# EAGLE design PCB-REMCON (EAGLE 6.4)
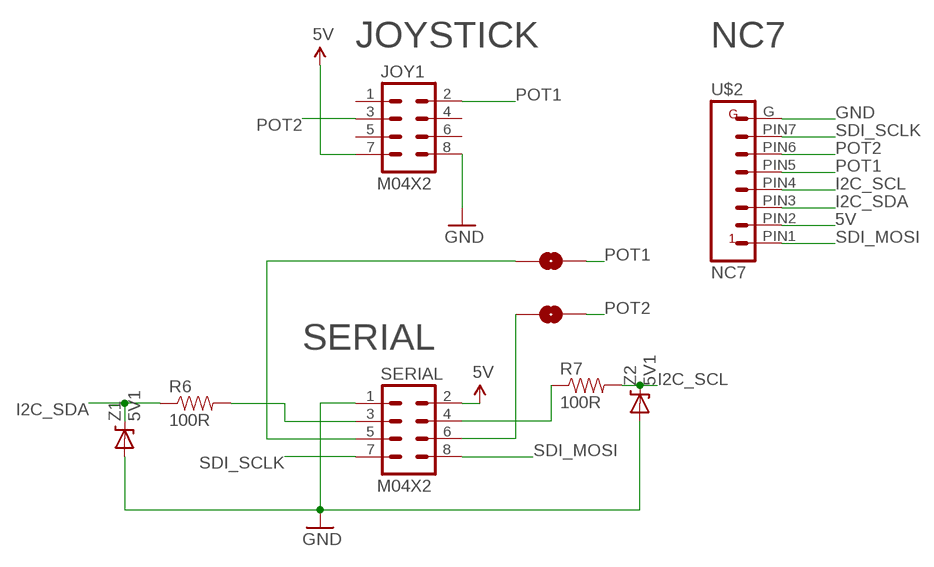
[diagram p0: schematic, sheet 1]

## Parts
JOY1  M04X2  [2X4]
R6  100R  RESISTOR0603-RES  [0603-RES]
R7  100R  RESISTOR0603-RES  [0603-RES]
SCLK->D1  SOLDERJUMPERNC  [SJ_2S]
SCLK->D5  SOLDERJUMPERNC  [SJ_2S]
SERIAL  M04X2  [2X4]
U$2  NC7  [NC7-MD-L1]
Z1  5V1  DIODE-ZENERPTH  [DIODE-ZENER]
Z2  5V1  DIODE-ZENERPTH  [DIODE-ZENER]

## Nets
5V [Power]: JOY1.7 SERIAL.2 U$2.PIN2
GND [Power]: JOY1.8 SERIAL.1 U$2.G Z1.P$2(A) Z2.P$2(A)
I2C_SCL: R7.2 U$2.PIN4 Z2.P$1(C)
I2C_SDA: R6.1 U$2.PIN3 Z1.P$1(C)
N$1: R6.2 SERIAL.3
N$2: SCLK->D5.1 SERIAL.6
N$3: SCLK->D1.1 SERIAL.5
N$14: R7.1 SERIAL.4
POT1: JOY1.2 SCLK->D1.2 U$2.PIN5
POT2: JOY1.3 SCLK->D5.2 U$2.PIN6
SDI_MOSI: SERIAL.8 U$2.PIN1
SDI_SCLK: SERIAL.7 U$2.PIN7
Unconnected: JOY1.1 JOY1.4 JOY1.5 JOY1.6

## Notes on the sheet
- JOYSTICK | NC7
- SERIAL

## Library data of the parts
JOY1 SERIAL = SparkFun:M04X2
R6 R7 = SparkFun:RESISTOR: Resistor Basic schematic elements and footprints for 0603, 1206, and PTH resistors.
SCLK->D1 SCLK->D5 = SparkFun:SOLDERJUMPER: Solder Jumper Standard SMD solder jumper. Used to automate production. Two varients : Normally Open and Normally Closed are the same, but have different paste layers. NC will have a large amount of paste and should jumper during reflow.
U$2 = SKAARHOJ:NC7
Z1 Z2 = SparkFun:DIODE-ZENER: Zener Diode Production Part - 8199 3.4V Zener Voltage

## Net classes
0 default: width 0.203 mm, drill 0.406 mm, clearance 0.203 mm
1 Power: width 0.406 mm, drill 0.61 mm, clearance 0.203 mm

## Board
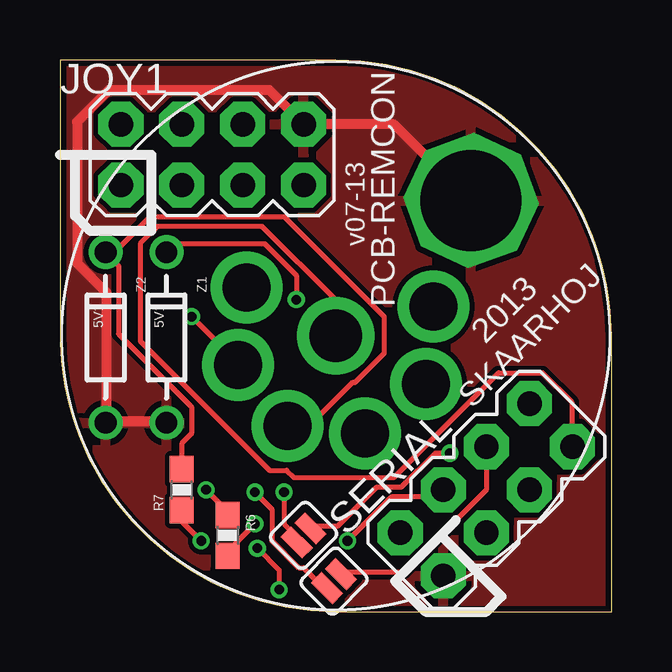
[diagram p1: board, top side]
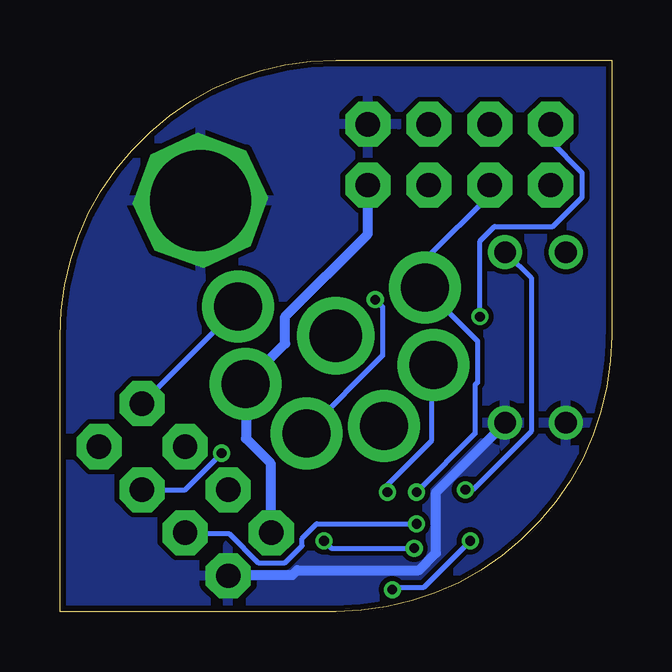
[diagram p2: board, bottom side, seen from below]

Size 23 x 23 mm. Coordinates in mm from the lower left corner, seen from the top.
Outline: 11.5,0 23,0 23,11.5 arc90 11.5,23 0,23 0,11.5
Outline: 0,11.5 arc90 11.5,0
Outline: 0,11.5 arc90 11.5,0
Copper layers (1*16): Top 0.035mm / dielectric 1.5mm / Bottom 0.035mm
Design rules "Fusion_eagle_rule_v1.1": minimum track width 6mil, minimum drill 12mil, track to track 6mil, track to pad 6mil, pad to pad 6mil, via to via 6mil, smd to smd 0mil, copper to edge 10mil, drill to drill 10mil, minimum pad ring 10mil, minimum via ring 6mil, stop-mask expansion 2mil, vias tented up to drill 100mil, thermal gap 10mil

### Footprints (pad centres in the part's own frame; a part is rotated, then mirrored left to right if it is on the bottom)
2X4 = drill 1.016 pad 1.88 octagon: 1 -3.81,-1.27; 2 -3.81,1.27; 3 -1.27,-1.27; 4 -1.27,1.27; 5 1.27,-1.27; 6 1.27,1.27; 7 3.81,-1.27; 8 3.81,1.27
0603-RES = smd 1.1 x 1: 1 -0.85,0; 2 0.85,0
SJ_2S = smd 0.635 x 1.27: 1 -0.412,0; 2 0.412,0
NC7-MD-L1 = drill 4.2 octagon: G 5.64,5.64 | drill 2: PIN1 4.068,1.22; PIN2 3.76,-2.01; PIN3 1.22,-4.07; PIN4 -2.01,-3.76; PIN5 -4.07,-1.22; PIN6 -3.72,2.01 | drill 2.2: PIN7 0,0
DIODE-ZENER = drill 0.9: P$1 -3.556,0; P$2 3.556,0

### Placement (x,y rotation side)
JOY1  6.35,19.05 0 top
R6  6.99,3.17 270 top
R7  5.08,5.08 90 top
SCLK->D1  10.16,3.17 225 top
SCLK->D5  11.43,1.27 225 top
SERIAL  17.78,5.08 45 top
U$2  11.5,11.5 0 top
Z1  4.45,11.43 270 top
Z2  1.91,11.43 270 top

### Tracks (layer width: path | path; a pad name or v marks a point on that pad's centre or on a via)
5V
  Bottom 0.406: SERIAL.2 14.22,3.35 14.22,6.2 15.24,7.21 15.24,9.45 U$2.PIN2 15.14,9.65 13.61,11.18 13.61,12.29 10.16,15.75 JOY1.7
GND
  Top 0.406: Z1.P$2 4.37,7.92 1.93,7.92 Z2.P$2 1.93,8.13 1.93,13.31 0.71,14.53 0.71,20.42 2.03,21.74 8.74,21.74 JOY1.8 13.92,20.32 17.07,17.17 U$2.G
  Bottom 0.406: Z1.P$2 4.47,7.82 7.32,4.98 7.32,2.44 8.03,1.73 13.11,1.73 13.31,1.52 15.95,1.52 SERIAL.1
  pour Top: 0,0 22.86,0 22.86,22.86 0,22.86
  pour Bottom: 0,0 22.86,0 22.86,22.86 0,22.86
I2C_SCL
  Top 0.203: R7.2 5.08,7.01 5.49,7.42 5.49,8.53 2.44,11.58 2.44,14.43 1.93,14.94 Z2.P$1 2.13,14.83 3.76,16.46 9.35,16.46 13.51,12.29 13.51,10.77 12.29,9.55 12.19,9.55 10.46,7.82 9.55,7.82 U$2.PIN4
I2C_SDA  (via drill 0.41)
  Top 0.203: v6.1,5.08 6.91,4.27 6.91,4.06 R6.1 | v9.86,13.01 9.86,14.02 8.53,15.34 4.78,15.34 4.47,15.04 Z1.P$1
  Bottom 0.203: v6.1,5.08 5.79,5.08 3.35,7.52 3.35,13.92 4.37,14.94 Z1.P$1 | v9.86,13.01 9.55,12.7 9.55,10.67 12.7,7.52 U$2.PIN3
N$1  (via drill 0.41)
  Top 0.203: v8.13,3.66 7.01,2.54 7.01,2.34 R6.2
  Bottom 0.203: v8.13,3.66 12.29,3.66 12.9,3.05 12.9,2.74 13.61,2.03 14.73,2.03 15.95,3.25 17.78,3.25 SERIAL.3
N$2
  Top 0.203: SERIAL.6 17.78,5.08 14.33,1.63 11.79,1.63 SCLK->D5.1
N$3  (via drill 0.41)
  Top 0.203: v16.26,6.6 15.65,6.6 14.22,5.18 13.21,5.18 11.58,3.56 10.46,3.56 SCLK->D1.1
  Bottom 0.203: v16.26,6.6 17.78,5.08 19.51,5.08 SERIAL.5
N$14  (via drill 0.41)
  Top 0.203: R7.1 5.08,3.76 v5.89,2.95 | v9.14,0.91 9.14,1.73 v8.23,2.64 | v11.99,2.95 13.82,4.78 15.65,4.78 15.95,5.08 SERIAL.4
  Bottom 0.203: v5.89,2.95 7.82,1.02 9.04,1.02 v9.14,0.91 | v8.23,2.64 11.68,2.64 v11.99,2.95
POT1  (via drill 0.41)
  Top 0.203: v9.35,4.98 9.35,3.66 9.86,3.15 9.86,2.95 SCLK->D1.2 | v5.49,12.29 7.42,10.36 U$2.PIN5
  Bottom 0.203: v9.35,4.98 9.35,5.28 7.52,7.11 7.52,10.26 U$2.PIN5 | JOY1.2 2.54,19.61 1.22,18.29 1.22,17.27 2.44,16.05 4.88,16.05 5.49,15.44 v5.49,12.29
POT2  (via drill 0.41)
  Top 0.203: v8.13,4.98 8.84,4.27 8.84,2.95 9.96,1.83 10.16,1.83 10.97,1.02 11.07,1.02 SCLK->D5.2
  Bottom 0.203: JOY1.3 5.08,17.37 7.72,14.73 7.72,13.51 U$2.PIN6 7.72,13.41 5.59,11.28 5.59,9.55 5.69,9.45 5.69,7.42 v8.13,4.98
SDI_MOSI
  Bottom 0.203: SERIAL.8 19.51,8.74 15.54,12.7 U$2.PIN1
SDI_SCLK
  Top 0.203: SERIAL.7 21.34,6.91 21.34,8.74 20.12,9.96 18.29,9.96 13.92,5.59 9.75,5.59 9.45,5.89 8.74,5.89 3.35,11.28 3.35,15.34 4.06,16.05 8.43,16.05 11.48,13.01 11.48,11.58 U$2.PIN7

### Text on the board
_tsilk: v07-13 | PCB-REMCON | 2013 / SKAARHOJ